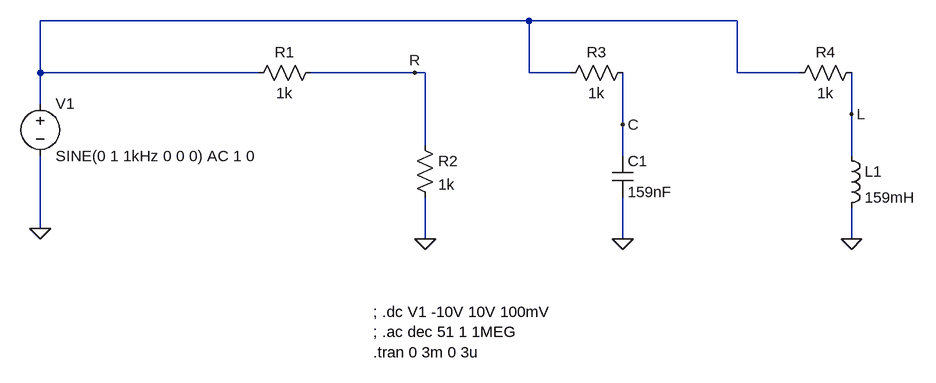
[diagram p0: schematic rlc.asc]
rlc.asc, the LTspice schematic file:
Version 4
SHEET 1 1636 732
WIRE 992 224 240 224
WIRE 1312 224 992 224
WIRE 240 304 240 224
WIRE 576 304 240 304
WIRE 816 304 656 304
WIRE 832 304 816 304
WIRE 992 304 992 224
WIRE 1056 304 992 304
WIRE 1312 304 1312 224
WIRE 1408 304 1312 304
WIRE 240 352 240 304
WIRE 1488 368 1488 304
WIRE 1136 384 1136 304
WIRE 832 416 832 304
WIRE 1136 432 1136 384
WIRE 1488 432 1488 368
WIRE 240 544 240 432
WIRE 832 560 832 496
WIRE 1136 560 1136 496
WIRE 1488 560 1488 512
FLAG 240 544 0
FLAG 832 560 0
FLAG 1136 560 0
FLAG 1488 560 0
FLAG 816 304 R
FLAG 1136 384 C
FLAG 1488 368 L
SYMBOL voltage 240 336 R0
SYMATTR InstName V1
SYMATTR Value SINE(0 1 1kHz 0 0 0) AC 1 0
SYMBOL res 816 400 R0
SYMATTR InstName R2
SYMATTR Value 1k
SYMBOL res 560 320 R270
WINDOW 0 32 56 VTop 2
WINDOW 3 0 56 VBottom 2
SYMATTR InstName R1
SYMATTR Value 1k
SYMBOL res 1040 320 R270
WINDOW 0 32 56 VTop 2
WINDOW 3 0 56 VBottom 2
SYMATTR InstName R3
SYMATTR Value 1k
SYMBOL res 1392 320 R270
WINDOW 0 32 56 VTop 2
WINDOW 3 0 56 VBottom 2
SYMATTR InstName R4
SYMATTR Value 1k
SYMBOL cap 1120 432 R0
SYMATTR InstName C1
SYMATTR Value 159nF
SYMBOL ind 1472 416 R0
SYMATTR InstName L1
SYMATTR Value 159mH
TEXT 752 672 Left 2 !; .dc V1 -10V 10V 100mV\n; .ac dec 51 1 1MEG\n.tran 0 3m 0 3u

The netlist it stands for:
* rlc.asc
V1 N001 0 SINE(0 1 1kHz 0 0 0) AC 1 0
R2 R 0 1k
R1 N001 R 1k
R3 N001 C 1k
R4 N001 L 1k
C1 C 0 159nF
L1 L 0 159mH
; .dc V1 -10V 10V 100mV
; .ac dec 51 1 1MEG
.tran 0 3m 0 3u
.backanno
.end